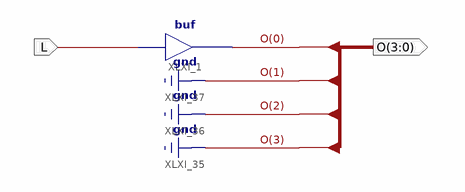
[diagram p0: schematic sheet 1]
// Xilinx ISE schematic resize1x4x0l.sch (spartan6) as structural Verilog: 1 symbols, 2 ports
module resize1x4x0l (
  input  L,
  output [3:0] O
);

  buf XLXI_1 (O[0], L);

  assign O[3:1] = 3'b000;
endmodule
